# EAGLE schematic sega (EAGLE 7.7.0)
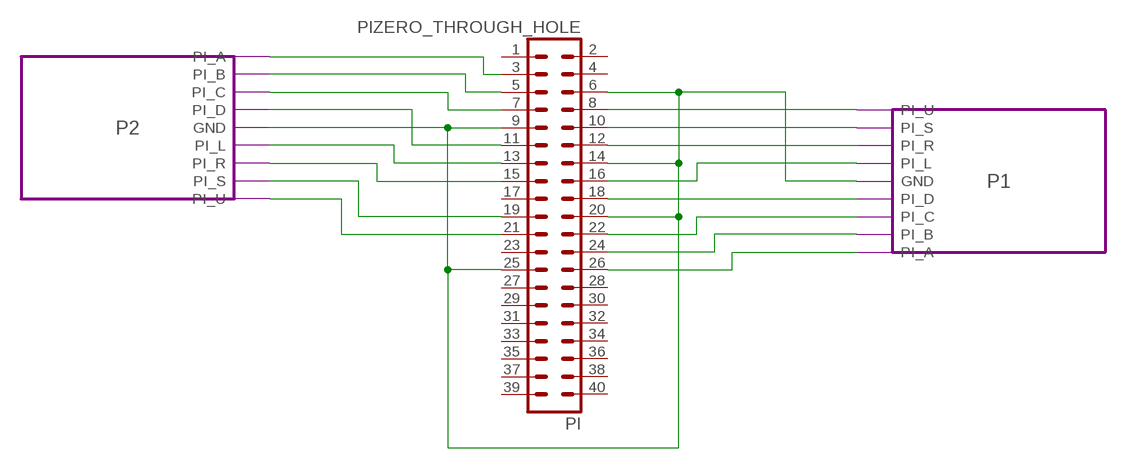
[diagram p0: schematic, sheet 1]

## Parts
PI  PIZERO_THROUGH_HOLE  [PIZERO_THOUGH_HOLE]

## Module instances
P1 = P
P2 = P

## Nets
GND: PI.6 PI.9 PI.14 PI.20 PI.25 ; port P1.GND P2.GND
N$1: PI.11 ; port P2.PI_D
N$3: PI.13 ; port P2.PI_L
N$4: PI.3 ; port P2.PI_A
N$5: PI.5 ; port P2.PI_B
N$6: PI.7 ; port P2.PI_C
N$7: PI.15 ; port P2.PI_R
N$8: PI.19 ; port P2.PI_S
N$9: PI.21 ; port P2.PI_U
N$10: PI.8 ; port P1.PI_U
N$11: PI.10 ; port P1.PI_S
N$12: PI.12 ; port P1.PI_R
N$13: PI.16 ; port P1.PI_L
N$14: PI.18 ; port P1.PI_D
N$15: PI.22 ; port P1.PI_C
N$16: PI.24 ; port P1.PI_B
N$17: PI.26 ; port P1.PI_A
Unconnected: PI.1 PI.2 PI.4 PI.17 PI.23 PI.27 PI.28 PI.29 PI.30 PI.31 PI.32 PI.33 PI.34 PI.35 PI.36 PI.37 PI.38 PI.39 PI.40

## Library data of the parts
PI = pizero:PIZERO_THROUGH_HOLE

## Module P
Ports: PI_A(in) PI_B(in) PI_C(in) PI_D(in) PI_L(in) PI_R(in) PI_S(in) PI_U(in) GND(pwr)
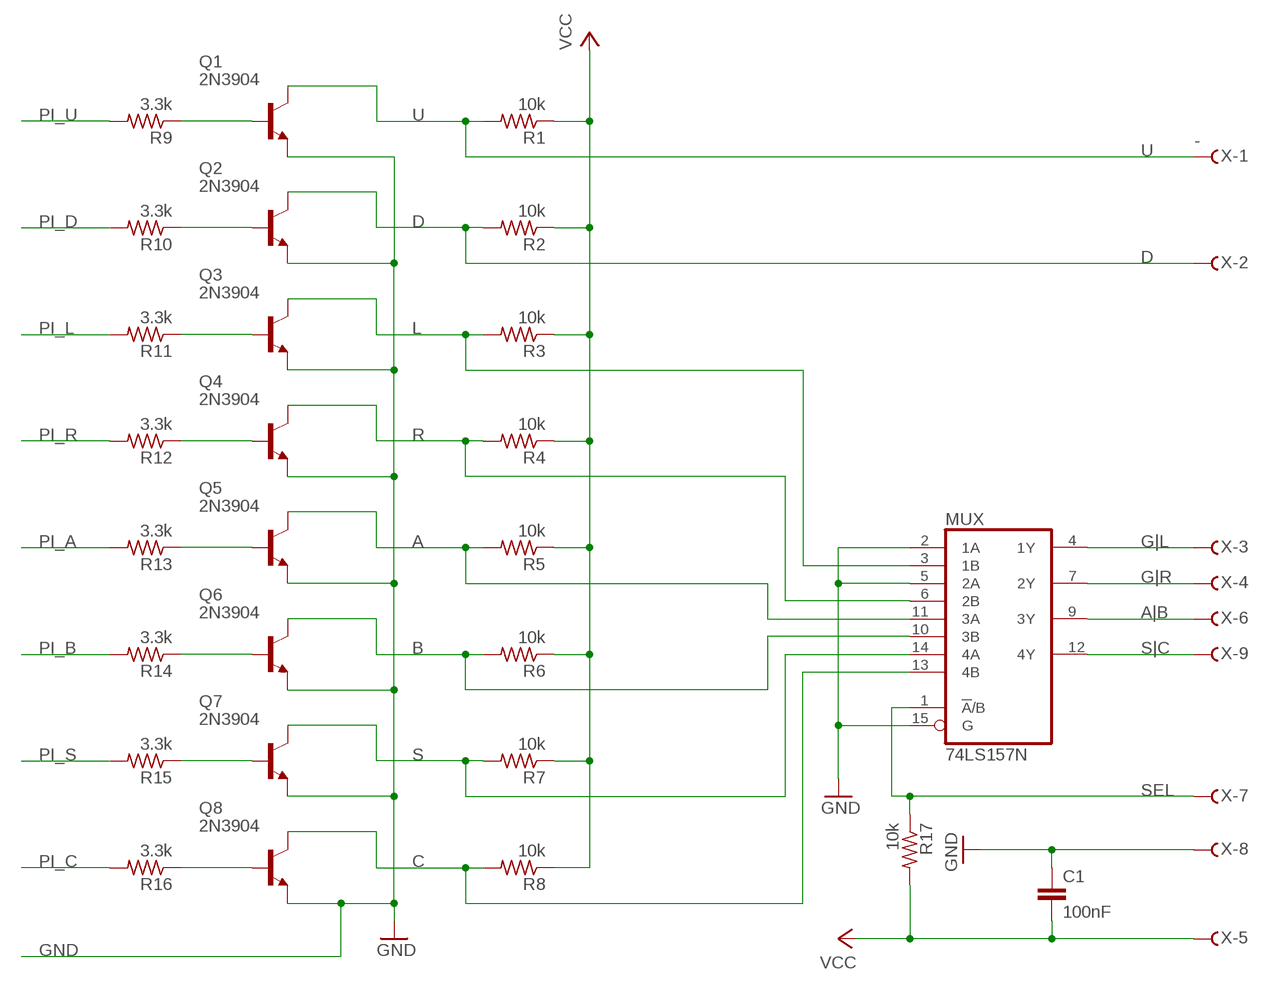
[diagram p1: schematic, module P, sheet 1]

### Parts
C1  100nF  C5/2.5  [C5B2.5]
MUX  74LS157N  [DIL16]
Q1  2N3904  [TO92]
Q2  2N3904  [TO92]
Q3  2N3904  [TO92]
Q4  2N3904  [TO92]
Q5  2N3904  [TO92]
Q6  2N3904  [TO92]
Q7  2N3904  [TO92]
Q8  2N3904  [TO92]
R1  10k  R-US_0207/10  [0207/10]
R2  10k  R-US_0207/10  [0207/10]
R3  10k  R-US_0207/10  [0207/10]
R4  10k  R-US_0207/10  [0207/10]
R5  10k  R-US_0207/10  [0207/10]
R6  10k  R-US_0207/10  [0207/10]
R7  10k  R-US_0207/10  [0207/10]
R8  10k  R-US_0207/10  [0207/10]
R9  3.3k  R-US_0207/10  [0207/10]
R10  3.3k  R-US_0207/10  [0207/10]
R11  3.3k  R-US_0207/10  [0207/10]
R12  3.3k  R-US_0207/10  [0207/10]
R13  3.3k  R-US_0207/10  [0207/10]
R14  3.3k  R-US_0207/10  [0207/10]
R15  3.3k  R-US_0207/10  [0207/10]
R16  3.3k  R-US_0207/10  [0207/10]
R17  10k  R-US_0207/10  [0207/10]
X  -  F09HS  [F09H]

### Nets
A: MUX.11(3A) Q5.1(C) R5.2
A|B: MUX.9(3Y) X.6
B: MUX.10(3B) Q6.1(C) R6.2
C: MUX.13(4B) Q8.1(C) R8.2
D: Q2.1(C) R2.2 X.2
GND: C1.1 MUX.2(1A) MUX.5(2A) MUX.15(G) Q1.3(E) Q2.3(E) Q3.3(E) Q4.3(E) Q5.3(E) Q6.3(E) Q7.3(E) Q8.3(E) X.8
G|L: MUX.4(1Y) X.3
G|R: MUX.7(2Y) X.4
L: MUX.3(1B) Q3.1(C) R3.2
N$2: Q1.2(B) R9.1
N$9: Q2.2(B) R10.1
N$10: Q3.2(B) R11.1
N$11: Q4.2(B) R12.1
N$12: Q5.2(B) R13.1
N$13: Q6.2(B) R14.1
N$14: Q7.2(B) R15.1
N$15: Q8.2(B) R16.1
PI_A: R13.2
PI_B: R14.2
PI_C: R16.2
PI_D: R10.2
PI_L: R11.2
PI_R: R12.2
PI_S: R15.2
PI_U: R9.2
R: MUX.6(2B) Q4.1(C) R4.2
S: MUX.14(4A) Q7.1(C) R7.2
SEL: MUX.1(!A!/B) R17.1 X.7
S|C: MUX.12(4Y) X.9
U: Q1.1(C) R1.2 X.1
VCC: C1.2 R1.1 R2.1 R3.1 R4.1 R5.1 R6.1 R7.1 R8.1 R17.2 X.5

### Power pins joined to a net without a drawn wire
GND: MUX.8(GND)
VCC: MUX.16(VCC)

### Library data of the parts
C1 = capacitor-wima:C: CAPACITOR naming: grid - package width
MUX = 74xx-us:74*157: Quadruple 2-line to 1-line data SELECTOR/MULTIPLEXER
Q1-Q8 = transistor-npn:2N3904: NPN Transistor
R1-R17 = resistor:R-US_: RESISTOR, American symbol
X = con-subd:F09?S: SUB-D; OC_FARNELL: unknown; OC_NEWARK: unknown